# EAGLE design beagleboard (EAGLE 7.7.0)
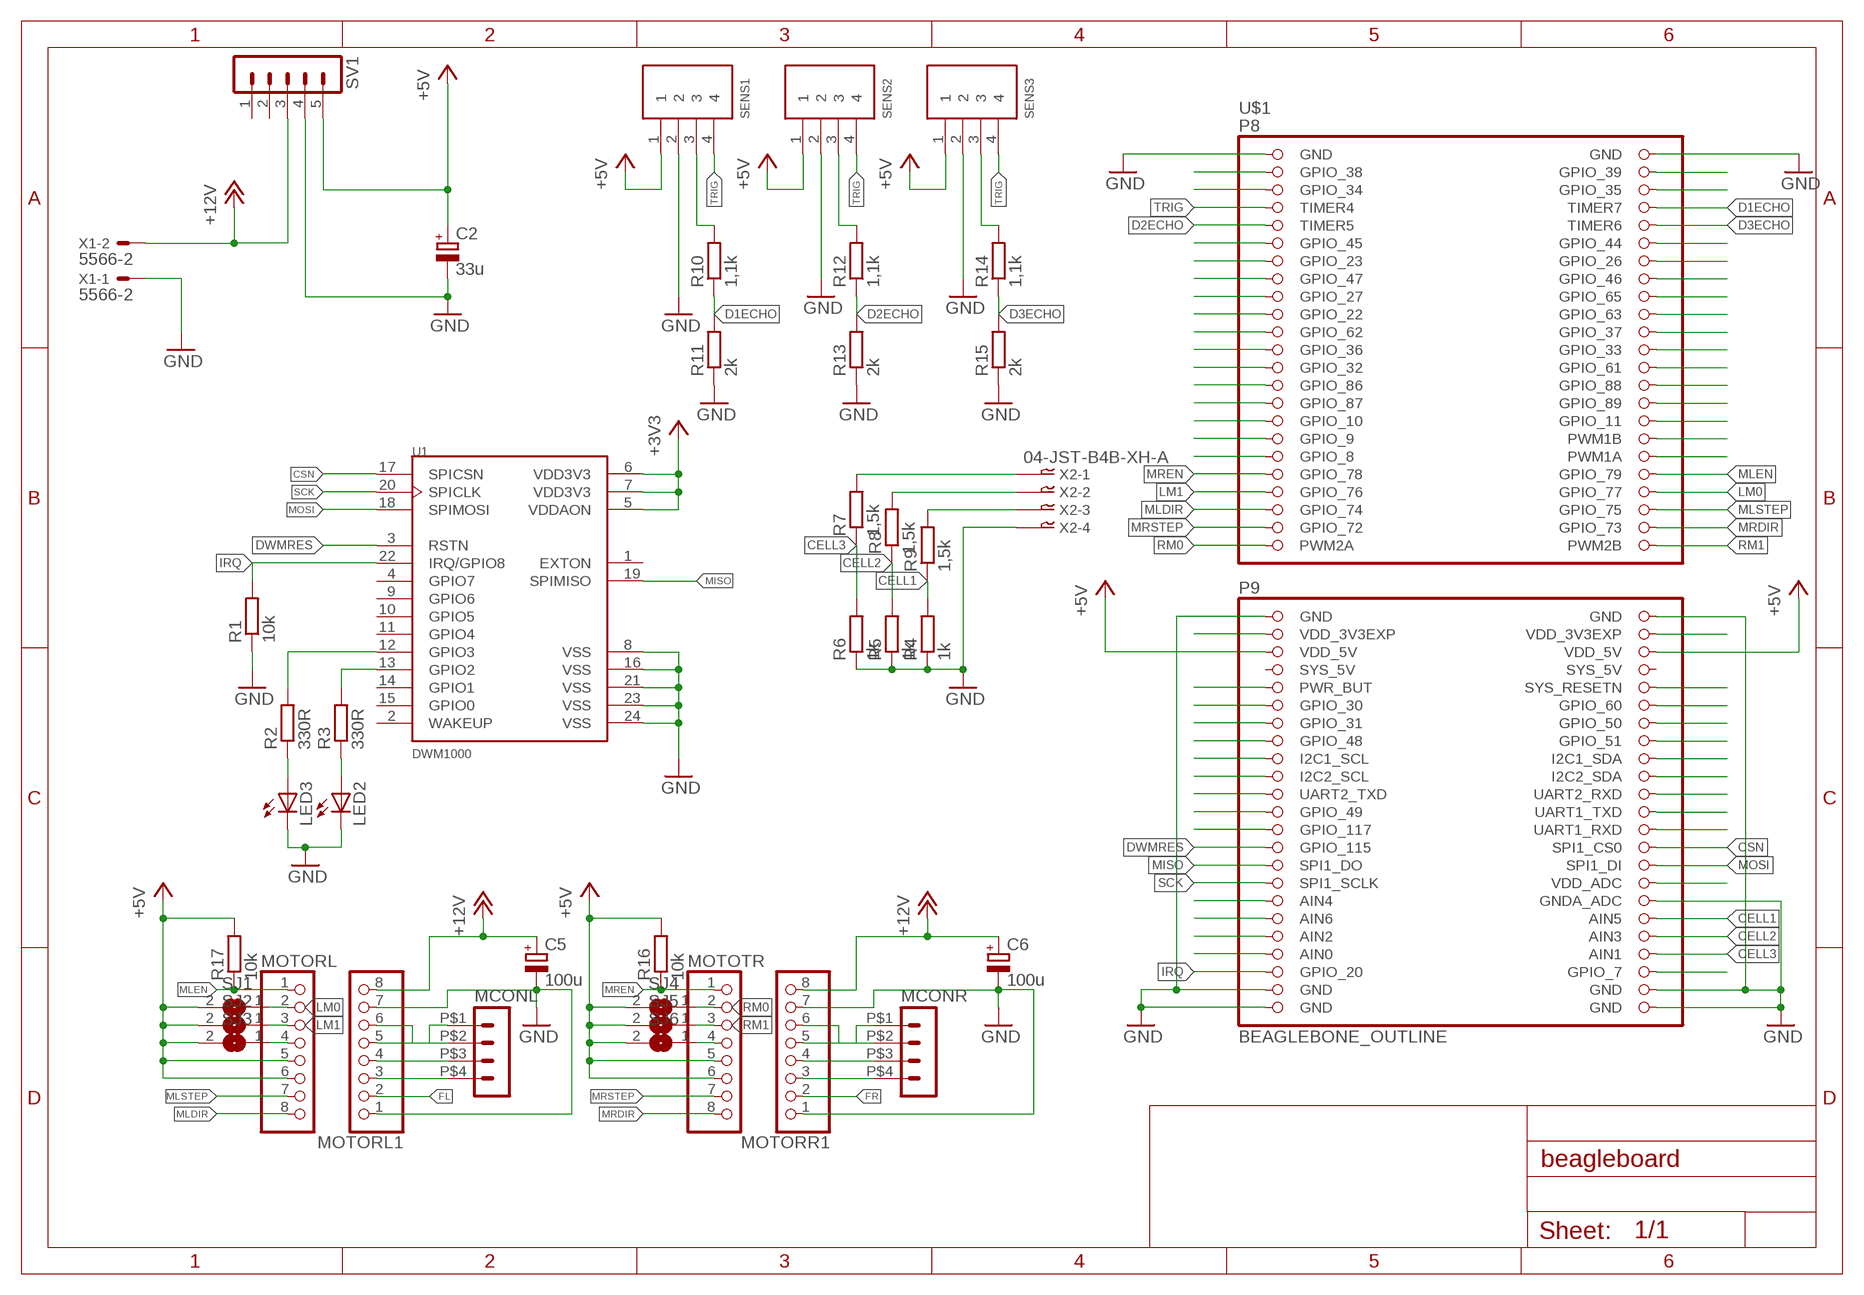
[diagram p0: schematic, sheet 1]

## Parts
C2  33u  CPOL-EU153CLV-0405  [153CLV-0405]
C5  100u  CPOL-EU153CLV-0405  [153CLV-0405]
C6  100u  CPOL-EU153CLV-0405  [153CLV-0405]
LED2  LEDSML0603  [SML0603]
LED3  LEDSML0603  [SML0603]
MCONL  HEADER_POS4_43045-0412  [43045-0412]
MCONR  HEADER_POS4_43045-0412  [43045-0412]
MOTORL  PINHD-1X8  [1X08]
MOTORL1  PINHD-1X8  [1X08]
MOTORR1  PINHD-1X8  [1X08]
MOTOTR  PINHD-1X8  [1X08]
R1  10k  R-EU_R0603  [R0603]
R2  330R  R-EU_R0603  [R0603]
R3  330R  R-EU_R0603  [R0603]
R4  1k  R-EU_R0805  [R0805]
R5  1k  R-EU_R0805  [R0805]
R6  1k  R-EU_R0805  [R0805]
R7  1,5k  R-EU_R0805  [R0805]
R8  1,5k  R-EU_R0805  [R0805]
R9  1,5k  R-EU_R0805  [R0805]
R10  1,1k  R-EU_R0805  [R0805]
R11  2k  R-EU_R0805  [R0805]
R12  1,1k  R-EU_R0805  [R0805]
R13  2k  R-EU_R0805  [R0805]
R14  1,1k  R-EU_R0805  [R0805]
R15  2k  R-EU_R0805  [R0805]
R16  10k  R-EU_R0805  [R0805]
R17  10k  R-EU_R0805  [R0805]
SENS1  4PIN  [B4B-PH-K-S]
SENS2  4PIN  [B4B-PH-K-S]
SENS3  4PIN  [B4B-PH-K-S]
SJ1  SJ  [SJ]
SJ2  SJ  [SJ]
SJ3  SJ  [SJ]
SJ4  SJ  [SJ]
SJ5  SJ  [SJ]
SJ6  SJ  [SJ]
SV1  MA05-1  [MA05-1]
U1  DWM1000  [XCVR_DWM1000]
U$1  BEAGLEBONE_OUTLINE  [BEAGLEBONE_SHIELD]
X1  5566-2  [5566-2]
X2  04-JST-B4B-XH-A  [B4B-XH]

## Nets
+3V3: U1.5(VDDAON) U1.6(VDD3V3) U1.7(VDD3V3)
+5V: C2.+ MOTORL.5 MOTORL.6 MOTOTR.5 MOTOTR.6 R16.2 R17.2 SENS1.1 SENS2.1 SENS3.1 SJ1.2 SJ2.2 SJ3.2 SJ4.2 SJ5.2 SJ6.2 SV1.5 U$1.51(VDD_5V) U$1.52(VDD_5V)
+12V: C5.+ C6.+ MOTORL1.8 MOTORR1.8 SV1.3 X1.2
CELL1: R4.2 R9.1 U$1.82(AIN5)
CELL2: R5.2 R8.1 U$1.84(AIN3)
CELL3: R6.2 R7.1 U$1.86(AIN1)
CSN: U1.17(SPICSN) U$1.74(SPI1_CS0)
D1ECHO: R10.1 R11.2 U$1.8(TIMER7)
D2ECHO: R12.1 R13.2 U$1.9(TIMER5)
D3ECHO: R14.1 R15.2 U$1.10(TIMER6)
D4ECHO: U$1.85(AIN0)
D4TRIG: U$1.83(AIN2)
DWMRES: U1.3(RSTN) U$1.73(GPIO_115)
FL: MOTORL1.2
FR: MOTORR1.2
GND: C2.- C5.- C6.- LED2.C LED3.C MOTORL1.1 MOTORL1.7 MOTORR1.1 MOTORR1.7 R1.1 R4.1 R5.1 R6.1 R11.1 R13.1 R15.1 SENS1.2 SENS2.2 SENS3.2 SV1.4 U1.8(VSS) U1.16(VSS) U1.21(VSS) U1.23(VSS) U1.24(VSS) U$1.1(GND) U$1.2(GND) U$1.47(GND) U$1.80(GNDA_ADC) U$1.89(GND) U$1.90(GND) U$1.91(GND) U$1.92(GND) X1.1 X2.P$4
IRQ: R1.2 U1.22(IRQ/GPIO8) U$1.87(GPIO_20)
LM0: MOTORL.2 SJ1.1 U$1.40(GPIO_77)
LM1: MOTORL.3 SJ2.1 U$1.39(GPIO_76)
MISO: U1.19(SPIMISO) U$1.75(SPI1_DO)
MLDIR: MOTORL.8 U$1.41(GPIO_74)
MLEN: MOTORL.1 R17.1 U$1.38(GPIO_79)
MLSTEP: MOTORL.7 U$1.42(GPIO_75)
MOSI: U1.18(SPIMOSI) U$1.76(SPI1_DI)
MRDIR: MOTOTR.8 U$1.44(GPIO_73)
MREN: MOTOTR.1 R16.1 U$1.37(GPIO_78)
MRSTEP: MOTOTR.7 U$1.43(GPIO_72)
N$1: MCONL.P$3 MOTORL1.4
N$2: R3.2 U1.13(GPIO2)
N$3: R2.2 U1.12(GPIO3)
N$4: R7.2 X2.P$1
N$5: LED2.A R3.1
N$6: LED3.A R2.1
N$7: R8.2 X2.P$2
N$8: R9.2 X2.P$3
N$9: MCONL.P$2 MOTORL1.6
N$10: MCONL.P$1 MOTORL1.5
N$11: MCONL.P$4 MOTORL1.3
N$12: MCONR.P$2 MOTORR1.6
N$13: MCONR.P$3 MOTORR1.4
N$14: MCONR.P$4 MOTORR1.3
N$15: MCONR.P$1 MOTORR1.5
N$16: U$1.48(GND)
N$17: U$1.3(GPIO_38)
N$18: U$1.4(GPIO_39)
N$19: U$1.5(GPIO_34)
N$20: U$1.12(GPIO_44)
N$21: U$1.6(GPIO_35)
N$22: U$1.16(GPIO_46)
N$23: U$1.11(GPIO_45)
N$25: U$1.14(GPIO_26)
N$26: U$1.15(GPIO_47)
N$27: U$1.18(GPIO_65)
N$28: U$1.20(GPIO_63)
N$29: U$1.22(GPIO_37)
N$30: U$1.24(GPIO_33)
N$31: U$1.26(GPIO_61)
N$32: U$1.28(GPIO_88)
N$33: U$1.30(GPIO_89)
N$34: U$1.32(GPIO_11)
N$35: U$1.34(PWM1B)
N$36: U$1.36(PWM1A)
N$39: U$1.55(PWR_BUT)
N$40: U$1.49(VDD_3V3EXP)
N$41: U$1.57(GPIO_30)
N$44: U$1.13(GPIO_23)
N$46: U$1.17(GPIO_27)
N$47: U$1.19(GPIO_22)
N$48: U$1.21(GPIO_62)
N$49: U$1.23(GPIO_36)
N$50: U$1.25(GPIO_32)
N$51: U$1.27(GPIO_86)
N$52: MOTORL.4 SJ3.1
N$53: U$1.59(GPIO_31)
N$54: U$1.61(GPIO_48)
N$55: U$1.71(GPIO_117)
N$56: U$1.29(GPIO_87)
N$57: U$1.31(GPIO_10)
N$58: U$1.33(GPIO_9)
N$59: U$1.35(GPIO_8)
N$60: U$1.65(I2C2_SCL)
N$61: U$1.50(VDD_3V3EXP)
N$62: U$1.56(SYS_RESETN)
N$63: U$1.58(GPIO_60)
N$64: U$1.60(GPIO_50)
N$65: U$1.62(GPIO_51)
N$66: MOTOTR.4 SJ6.1
N$67: U$1.81(AIN6)
N$68: U$1.64(I2C1_SDA)
N$69: U$1.66(I2C2_SDA)
N$70: U$1.78(VDD_ADC)
N$71: U$1.68(UART2_RXD)
N$72: U$1.70(UART1_TXD)
N$73: U$1.72(UART1_RXD)
N$74: U$1.67(UART2_TXD)
N$75: U$1.69(GPIO_49)
N$76: R10.2 SENS1.3
N$77: U$1.88(GPIO_7)
N$78: R12.2 SENS2.3
N$79: U$1.63(I2C1_SCL)
N$80: R14.2 SENS3.3
N$104: U$1.79(AIN4)
RM0: MOTOTR.2 SJ4.1 U$1.45(PWM2A)
RM1: MOTOTR.3 SJ5.1 U$1.46(PWM2B)
SCK: U1.20(SPICLK) U$1.77(SPI1_SCLK)
TRIG: SENS1.4 SENS2.4 SENS3.4 U$1.7(TIMER4)
Unconnected: SV1.1 SV1.2 U1.1(EXTON) U1.2(WAKEUP) U1.4(GPIO7) U1.9(GPIO6) U1.10(GPIO5) U1.11(GPIO4) U1.14(GPIO1) U1.15(GPIO0) U$1.54(SYS_5V)

## Power pins joined to a net without a drawn wire
SYS_5V: U$1.53(SYS_5V)

## Library data of the parts
C2 C5 C6 = rcl:CPOL-EU: POLARIZED CAPACITOR, European symbol
LED2 LED3 = led:LED: LED OSRAM: - CHIPLED LG R971, LG N971, LY N971, LG Q971, LY Q971, LO R971, LY R971 LH N974, LH R974 LS Q976, LO Q976, LY Q976 LO Q996 - Hyper CHIPLED LW Q18S LB Q993, LB Q99A, LB R99A - SideLED LS A670, LO A670, LY A670, LG A670, LP A670 LB A673, LV A673, LT A673, LW A673 LH A674 LY A675 LS A676, LA A676, LO A676, LY A676, LW A676 LS A679, LY A679, LG A679 - Hyper Micro SIDELED® LS Y876, LA Y876, LO Y876, LY Y876 LT Y87S - SmartLED LW L88C, LW L88S LB L89C, LB L89S, LG L890 LS L89K, LO L89K, LY L89K LS L896, LA L896, LO L896, LY L896 - TOPLED LS T670, LO T670, LY T670, LG T670, LP T670 LSG T670, LSP T670, LSY T670, LOP T670, LYG T670 LG T671, LOG T671, LSG T671 LB T673, LV T673, LT T673, LW T673 LH T674 LS T676, LA T676, LO T676, LY T676, LB T676, LH T676, LSB T676, LW T676 LB T67C, LV T67C, LT T67C, LS T67K, LO T67K, LY T67K, LW E67C LS E67B, LA E67B, LO E67B, LY E67B, LB E67C, LV E67C, LT E67C LW T67C LS T679, LY T679, LG T679 LS T770, LO T770, LY T770, LG T770, LP T770 LB T773, LV T773, LT T773, LW T773 LH T774 LS E675, LA E675, LY E675, LS T675 LS T776, LA T776, LO T776, LY T776, LB T776 LHGB T686 LT T68C, LB T68C - Hyper Mini TOPLED® LB M676 - Mini TOPLED Santana® LG M470 LS M47K, LO M47K, LY M47K Source: http://www.osram.convergy.de LUXEON: - LUMILED® LXK2-PW12-R00, LXK2-PW12-S00, LXK2-PW14-U00, LXK2-PW14-V00 LXK2-PM12-R00, LXK2-PM12-S00, LXK2-PM14-U00 LXK2-PE12-Q00, LXK2-PE12-R00, LXK2-PE12-S00, LXK2-PE14-T00, LXK2-PE14-U00 LXK2-PB12-K00, LXK2-PB12-L00, LXK2-PB12-M00, LXK2-PB14-N00, LXK2-PB14-P00, LXK2-PB14-Q00 LXK2-PR12-L00, LXK2-PR12-M00, LXK2-PR14-Q00, LXK2-PR14-R00 LXK2-PD12-Q00, LXK2-PD12-R00, LXK2-PD12-S00 LXK2-PH12-R00, LXK2-PH12-S00 LXK2-PL12-P00, LXK2-PL12-Q00, LXK2-PL12-R00 Source: www.luxeon.com KINGBRIGHT: KA-3528ASYC Source: www.kingbright.com
MCONL MCONR = con-molex-micro-fit-3_0:HEADER_POS4_?: Molex - Micro-Fit 3.0 Series connector, 3.00mm (0.118") pitch header, 4 positions.
MOTORL MOTORL1 MOTORR1 MOTOTR = pinhead:PINHD-1X8: PIN HEADER
R1-R17 = rcl:R-EU_: RESISTOR, European symbol
SENS1-SENS3 = libsjst_eph:4PIN
SJ1-SJ6 = jumper:SJ: SMD solder JUMPER
SV1 = con-lstb:MA05-1: PIN HEADER; OC_FARNELL: unknown; OC_NEWARK: unknown
U1 = DWM1000:DWM1000: Mod Ieee802.15.4-2011 Uwb Txrx
U$1 = adafruit:BEAGLEBONE_OUTLINE: Should match A3 pinout - but not completely tested
X1 = con-molex:5566-2: Mini FIT connector 2 pol Source: http://www.molex.com; OC_FARNELL: 1822072; OC_NEWARK: unknown
X2 = bt_con-jst-xh:04-JST: JST CONNECTOR

## Net classes
0 default: clearance 0.205 mm

## Board
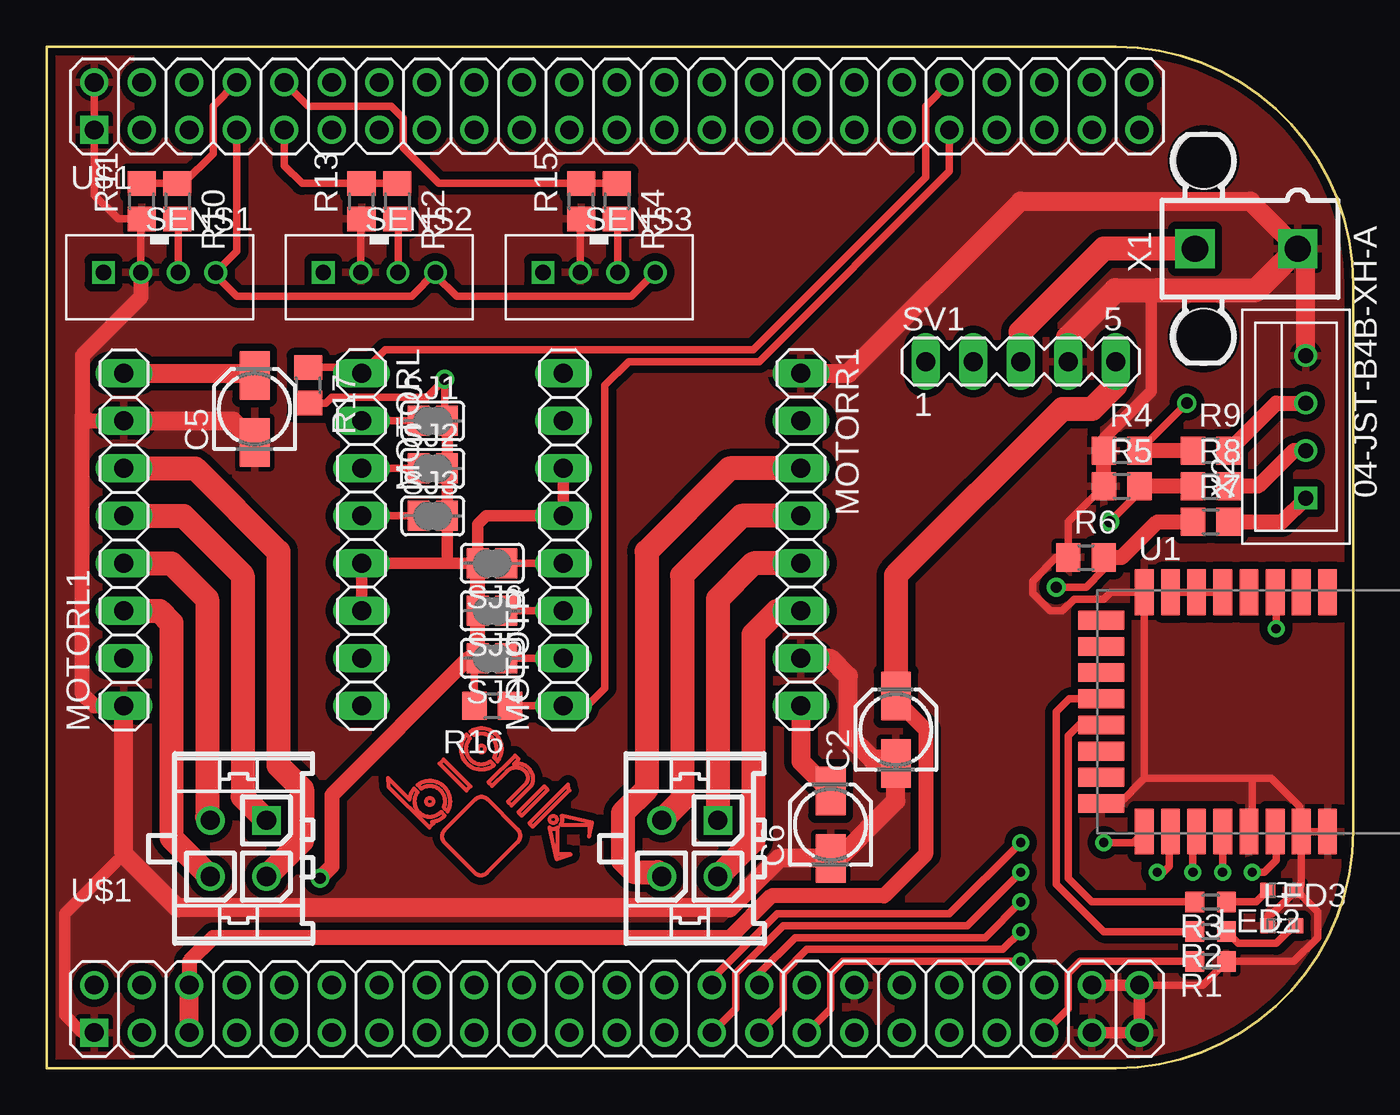
[diagram p1: board, top side]
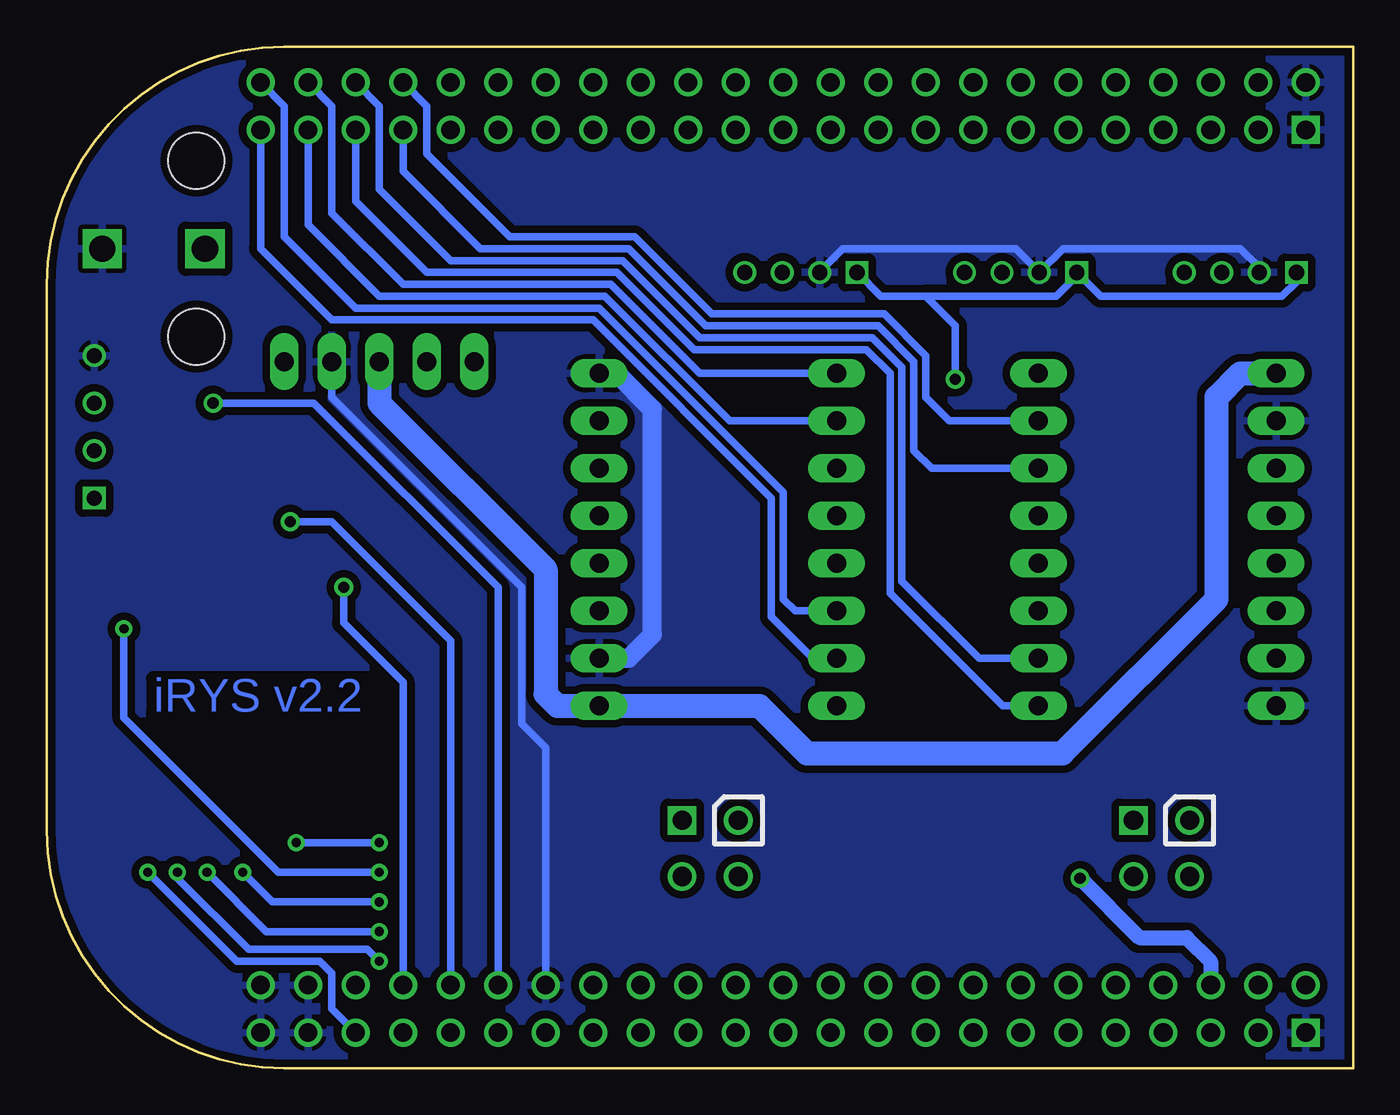
[diagram p2: board, bottom side, seen from below]

Size 69.85 x 54.61 mm. Coordinates in mm from the lower left corner, seen from the top.
Copper layers (1*16): Top 0.035mm / dielectric 1.5mm / Bottom 0.035mm
Design rules "default *": minimum track width 10mil, minimum drill 24mil, track to track 8mil, track to pad 8mil, pad to pad 8mil, via to via 8mil, smd to smd 8mil, copper to edge 8mil, drill to drill 8mil, minimum pad ring 8mil, minimum via ring 8mil, stop-mask expansion 4mil, vias tented up to drill 0mil, thermal gap 10mil

### Footprints (pad centres in the part's own frame; a part is rotated, then mirrored left to right if it is on the bottom)
153CLV-0405 = smd 2.6 x 1.6: + 1.8,0; - -1.8,0
SML0603 = smd 0.8 x 0.8: A 0.75,0; C -0.75,0
43045-0412 = drill 1.02 square: P$1 1.5,0 | drill 1.02: P$2 -1.5,0; P$3 1.5,3; P$4 -1.5,3
1X08 = drill 1.016 long: 1 -8.89,0; 2 -6.35,0; 3 -3.81,0; 4 -1.27,0; 5 1.27,0; 6 3.81,0; 7 6.35,0; 8 8.89,0
R0603 = smd 1 x 1.1: 1 -0.85,0; 2 0.85,0
R0805 = smd 1.3 x 1.5: 1 -0.95,0; 2 0.95,0
B4B-PH-K-S = drill 0.813 square: 1 3,0 | drill 0.813: 2 1,0; 3 -1,0; 4 -3,0
SJ = smd 1.168 x 1.6: 1 -0.762,0; 2 0.762,0
MA05-1 = drill 1.016 long: 1 -5.08,0; 2 -2.54,0; 3 0,0; 4 2.54,0; 5 5.08,0
XCVR_DWM1000 = smd 2.45 x 1: 1 -6.4,1.8; 2 -6.4,0.4; 3 -6.4,-1; 4 -6.4,-2.4; 5 -6.4,-3.8; 6 -6.4,-5.2; 7 -6.4,-6.6; 8 -6.4,-8; 17 6.4,-8; 18 6.4,-6.6; 19 6.4,-5.2; 20 6.4,-3.8; 21 6.4,-2.4; 22 6.4,-1; 23 6.4,0.4; 24 6.4,1.8 | smd 1 x 2.45: 9 -4.9,-10.295; 10 -3.5,-10.295; 11 -2.1,-10.295; 12 -0.7,-10.295; 13 0.7,-10.295; 14 2.1,-10.295; 15 3.5,-10.295; 16 4.9,-10.295
BEAGLEBONE_SHIELD = drill 1 square: 1 4.445,2.54; 47 52.705,2.54 | drill 1: 2 1.905,2.54; 3 4.445,5.08; 4 1.905,5.08; 5 4.445,7.62; 6 1.905,7.62; 7 4.445,10.16; 8 1.905,10.16; 9 4.445,12.7; 10 1.905,12.7; 11 4.445,15.24; 12 1.905,15.24; 13 4.445,17.78; 14 1.905,17.78; 15 4.445,20.32; 16 1.905,20.32; 17 4.445,22.86; 18 1.905,22.86; 19 4.445,25.4; 20 1.905,25.4; 21 4.445,27.94; 22 1.905,27.94; 23 4.445,30.48; 24 1.905,30.48; 25 4.445,33.02; 26 1.905,33.02; 27 4.445,35.56; 28 1.905,35.56; 29 4.445,38.1; 30 1.905,38.1; 31 4.445,40.64; 32 1.905,40.64; 33 4.445,43.18; 34 1.905,43.18; 35 4.445,45.72; 36 1.905,45.72; 37 4.445,48.26; 38 1.905,48.26; 39 4.445,50.8; 40 1.905,50.8; 41 4.445,53.34; 42 1.905,53.34; 43 4.445,55.88; 44 1.905,55.88; 45 4.445,58.42; 46 1.905,58.42; 48 50.165,2.54; 49 52.705,5.08; 50 50.165,5.08; 51 52.705,7.62; 52 50.165,7.62; 53 52.705,10.16; 54 50.165,10.16; 55 52.705,12.7; 56 50.165,12.7; 57 52.705,15.24; 58 50.165,15.24; 59 52.705,17.78; 60 50.165,17.78; 61 52.705,20.32; 62 50.165,20.32; 63 52.705,22.86; 64 50.165,22.86; 65 52.705,25.4; 66 50.165,25.4; 67 52.705,27.94; 68 50.165,27.94; 69 52.705,30.48; 70 50.165,30.48; 71 52.705,33.02; 72 50.165,33.02; 73 52.705,35.56; 74 50.165,35.56; 75 52.705,38.1; 76 50.165,38.1; 77 52.705,40.64; 78 50.165,40.64; 79 52.705,43.18; 80 50.165,43.18; 81 52.705,45.72; 82 50.165,45.72; 83 52.705,48.26; 84 50.165,48.26; 85 52.705,50.8; 86 50.165,50.8; 87 52.705,53.34; 88 50.165,53.34; 89 52.705,55.88; 90 50.165,55.88; 91 52.705,58.42; 92 50.165,58.42
5566-2 = drill 1.4 square: 1 0,-2.75; 2 0,2.75 | hole 3: 4.7,2.29; -4.7,2.29
B4B-XH = drill 0.8 square: P$1 -3.81,0 | drill 0.8: P$2 -1.27,0; P$3 1.27,0; P$4 3.81,0

### Placement (x,y rotation side)
C2  45.4,18.1 90 top
C5  11.11,35.24 90 top
C6  41.91,13.02 90 top
LED2  66.04,9.53 180 top
LED3  66.04,7.62 0 top
MCONL  11.75,11.75 90 top
MCONR  35.88,11.75 90 top
MOTORL  16.83,28.26 270 top
MOTORL1  4.13,28.26 90 top
MOTORR1  40.32,28.26 270 top
MOTOTR  27.62,28.26 90 top
R1  62.23,5.72 180 top
R2  62.23,7.3 180 top
R3  62.23,8.89 180 top
R4  57.47,33.02 0 top
R5  57.47,31.12 0 top
R6  55.56,27.31 0 top
R7  62.23,29.21 0 top
R8  62.23,31.12 0 top
R9  62.23,33.02 0 top
R10  6.99,46.36 270 top
R11  5.08,46.36 90 top
R12  18.73,46.36 270 top
R13  16.83,46.36 90 top
R14  30.48,46.36 270 top
R15  28.57,46.36 90 top
R16  23.81,19.37 180 top
R17  13.97,36.51 270 top
SENS1  6.03,42.55 180 top
SENS2  17.78,42.55 180 top
SENS3  29.53,42.55 180 top
SJ1  20.64,34.61 0 top
SJ2  20.64,32.07 0 top
SJ3  20.64,29.53 0 top
SJ4  23.81,21.91 180 top
SJ5  23.81,24.45 180 top
SJ6  23.81,26.99 180 top
SV1  52.07,37.78 0 top
U1  66.67,19.05 270 top
U$1  0,54.61 270 top
X1  64.13,43.82 90 top
X2  67.31,34.29 90 top

### Tracks (layer width: path | path; a pad name or v marks a point on that pad's centre or on a via)
+3V3
  Top 0.406: U1.5 U1.6 U1.7
+5V  (via drill 0.6, 0.6 pad 1.02)
  Top 0.406: SJ1.2 21.27,34.73 v21.27,36.83 20.32,35.88 15.24,35.88 14.93,35.56 R17.2 | R16.2 22.86,21.72 SJ4.2
  Top 0.61: MOTOTR.6 MOTOTR.5 23.5,29.53 23.05,29.08 SJ6.2 21.27,26.99 | MOTORL.6 MOTORL.5 21.27,26.99 | 21.27,26.99 21.4,27.12 SJ3.2 SJ2.2 SJ1.2
  Top 0.813: SJ6.2 SJ5.2 SJ4.2 22.54,21.91 15.24,14.61 15.24,10.8 v14.61,10.16 | 45.4,26.35 45.4,19.69 46.99,18.1 46.99,11.43 44.77,9.21 38.73,9.21 36.51,6.99 8.89,6.99 7.62,5.72 U$1.52
  Top 1.016: U$1.51 U$1.52
  Top 1.27: SV1.5 57.15,36.51 55.88,35.24 54.29,35.24 45.4,26.35 C2.+
  Bottom 0.406: SENS1.1 3.03,42.05 3.81,41.27 13.51,41.27 SENS2.1 14.78,42.37 15.88,41.27 22.86,41.27 | SENS3.1 25.26,41.27 22.86,41.27 | 22.86,41.27 21.27,39.69 v21.27,36.83
  Bottom 0.813: v14.61,10.16 11.43,6.99 8.89,6.99 7.62,5.72 U$1.52
+12V
  Top 1.016: MOTORL1.8 11.01,37.15 C5.+ | MOTORR1.8 40.32,16.41 C6.+
  Top 1.27: X1.2 56.52,43.82 52.07,39.37 SV1.3
  Bottom 1.27: SV1.3 52.07,35.56 43.18,26.67 43.18,20 42.55,19.37 MOTORR1.8 31.75,19.37 29.21,16.83 15.56,16.83 7.3,25.08 7.3,35.88 6.03,37.15 MOTORL1.8
CELL1  (via drill 0.6 pad 1.02)
  Top 0.406: R4.2 v60.96,35.56
  Top 0.813: R9.1 R4.2
  Bottom 0.406: v60.96,35.56 55.56,35.56 45.72,25.72 U$1.82
CELL2  (via drill 0.6 pad 1.02)
  Top 0.406: R5.2 58.42,30.8 v56.83,29.21
  Top 0.813: R8.1 R5.2
  Bottom 0.406: v56.83,29.21 54.61,29.21 48.26,22.86 U$1.84
CELL3  (via drill 0.6 pad 1.02)
  Top 0.406: R6.2 56.51,26.67 55.56,25.72 v53.98,25.72
  Top 0.813: R6.2 57.47,27.31 59.37,29.21 R7.1
  Bottom 0.406: v53.98,25.72 53.98,23.81 50.8,20.64 U$1.86
CSN  (via drill 0.5)
  Top 0.406: U$1.74 35.56,4.76 39.05,8.26 48.26,8.26 v52.07,12.07 | v56.52,12.07 58.09,12.07 U1.17
  Bottom 0.406: v52.07,12.07 v56.52,12.07
D1ECHO
  Top 0.406: R11.2 R10.1 7.3,47.3 8.89,48.9 8.89,51.44 U$1.8
D2ECHO
  Top 0.406: R12.1 R13.2 13.66,47.3 12.7,48.26 U$1.9
D3ECHO
  Top 0.406: R14.1 R15.2 20.96,47.3 19.05,49.21 19.05,50.8 18.41,51.44 13.97,51.44 U$1.10
DWMRES  (via drill 0.5)
  Top 0.406: U$1.73 36.83,3.18 36.83,5.08 39.37,7.62 49.21,7.62 v52.07,10.48 | v65.72,23.5 65.72,25.4 U1.3
  Bottom 0.406: v52.07,10.48 57.47,10.48 65.72,18.73 v65.72,23.5
GND
  Top 0.406: U1.24 U1.23 | U1.23 67.07,9.81 LED2.C | LED3.C 65.29,8.14 65.4,8.26 65.52,8.26 LED2.C | R1.1 66.67,5.72 67.94,6.99 67.94,8.37 LED2.C | U1.16 57.33,14.15 58.68,15.5 | SENS2.2 16.78,45.36 R13.1 | SENS3.2 28.53,45.36 R15.1 | SENS1.2 5.03,45.36 R11.1 3.81,45.4 2.54,46.67 U$1.1 U$1.2 | R5.1 54.61,29.21 R6.1 53.98,27.31 52.7,26.04 52.7,25.4 53.66,24.45 54.29,24.45 54.93,25.08 56.52,25.08 56.88,25.45 U1.8 58.68,15.5 | U$1.92 61.81,4.45 R1.1 | U1.21 64.45,12.83 64.45,15.5 | R1.1 62.87,5.72 | 58.68,15.5 64.45,15.5 | 64.45,15.5 65.47,15.5 66.99,13.97 66.99,12.73 U1.23
  Top 0.61: U$1.89 U$1.91 U$1.92 U$1.90 | U$1.47 1.91,1.91 0.95,2.86 0.95,8.26 4.13,11.43 | R4.1 56.52,33.66 59.05,36.2 59.05,41.27 59.37,41.59
  Top 0.813: 45.19,16.51 C2.- | R5.1 R4.1 | SENS1.2 5.03,41.23 1.91,38.1 1.91,34.93 | 1.91,34.93 2.22,34.61 MOTORL1.7 | MOTORL1.1 2.54,19.37 1.91,20 1.91,34.93
  Top 1.016: MOTORL1.7 9.95,34.61 C5.- | X2.P$4 67.31,43.39 X1.1 64.34,46.36 52.07,46.36 42.86,37.15 MOTORR1.1 | MOTORL1.1 4.13,11.43 6.99,8.57 36.51,8.57 39.16,11.22 C6.- 42.33,11.22 45.4,14.29 C2.- | 45.19,16.51 44.13,16.51 42.86,17.78 42.86,20.96 41.91,21.91 MOTORR1.7
  Top 1.27: SV1.4 54.61,39.05 57.15,41.59 59.37,41.59 64.66,41.59 X1.1
  Bottom 0.406: SENS1.2 5.03,42.82 6.03,43.82 15.51,43.82 SENS2.2 18.05,43.82 27.3,43.82 28.53,42.59 SENS3.2 | U$1.80 43.18,17.15 44.45,18.42 44.45,25.72 54.61,35.88 SV1.4
  Bottom 1.016: MOTORR1.7 38.73,21.91 37.47,23.18 37.47,35.24 39.37,37.15 MOTORR1.1
  pour Top (isolate 0.406): 0,54.61 0,0 57.79,0 arc90 69.85,12.07 69.85,42.55 arc90 57.79,54.61 57.15,54.61
  pour Bottom (isolate 0.406): 0,0 57.79,0 arc90 69.85,12.07 69.85,41.91 69.85,42.55 arc90 57.79,54.61 0,54.61
IRQ  (via drill 0.5)
  Top 0.406: v64.45,10.48 65.09,10.48 65.72,11.11 65.72,12.6 U1.22 | U$1.87 54.61,3.18 54.61,5.08 55.24,5.72 R1.2
  Bottom 0.406: v64.45,10.48 59.69,5.72 55.24,5.72 54.61,5.08 54.61,3.18 U$1.87
LM0
  Top 0.406: MOTORL.2 SJ1.1
  Bottom 0.406: U$1.40 49.53,51.44 49.53,48.9 45.09,44.45 38.42,44.45 34.29,40.32 25.08,40.32 22.86,38.1 22.86,35.88 21.59,34.61 MOTORL.2
LM1
  Top 0.406: MOTORL.3 SJ2.1
  Bottom 0.406: U$1.39 50.8,47.94 46.67,43.82 38.73,43.82 34.61,39.69 25.4,39.69 23.5,37.78 23.5,33.02 22.54,32.07 MOTORL.3
MISO  (via drill 0.5)
  Top 0.406: U$1.75 39.37,3.18 39.37,5.08 40.64,6.35 51.12,6.35 v52.07,7.3 | v61.28,10.48 61.28,12.45 U1.19
  Bottom 0.406: v52.07,7.3 58.1,7.3 v61.28,10.48
MLDIR
  Bottom 0.406: U$1.41 53.34,46.36 49.53,42.55 39.37,42.55 35.24,38.42 26.04,38.42 24.77,37.15 24.77,25.4 18.73,19.37 MOTORL.8
MLEN
  Top 0.406: U$1.38 46.99,51.44 46.99,47.62 37.78,38.42 18.1,38.42 MOTORL.1 16.51,37.46 R17.1
MLSTEP
  Bottom 0.406: U$1.42 52.07,51.44 52.07,46.99 48.26,43.18 39.05,43.18 34.93,39.05 25.72,39.05 24.13,37.47 24.13,26.04 20,21.91 MOTORL.7
MOSI  (via drill 0.5)
  Top 0.406: v52.07,8.89 50.16,6.99 40.01,6.99 38.1,5.08 U$1.76 | v59.37,10.48 59.69,10.48 60.01,10.8 60.01,12.58 U1.18
  Bottom 0.406: v52.07,8.89 57.79,8.89 v59.37,10.48
MRDIR
  Bottom 0.406: U$1.44 54.61,51.44 54.61,45.72 50.8,41.91 39.69,41.91 34.93,37.15 MOTOTR.8
MREN
  Top 0.406: U$1.37 48.26,47.94 38.1,37.78 31.12,37.78 29.84,36.51 29.84,20.32 28.89,19.37 MOTOTR.1 R16.1
MRSTEP
  Bottom 0.406: U$1.43 55.88,45.09 52.07,41.27 40.01,41.27 33.34,34.61 MOTOTR.7
N$1
  Top 1.27: MOTORL1.4 6.67,26.99 8.57,25.08 8.57,13.42 MCONL.P$3
N$2
  Top 0.406: R3.2 55.88,8.89 54.61,10.16 54.61,17.78 55.24,18.42 56.31,18.42 U1.13
N$3
  Top 0.406: U1.12 54.68,19.75 53.98,19.05 53.98,9.84 56.52,7.3 R2.2
N$4
  Top 0.813: R7.2 66.04,29.21 X2.P$1
N$5
  Top 0.406: R3.1 64.65,8.89 LED2.A
N$6
  Top 0.406: LED3.A 66.15,7.1 65.72,6.67 63.71,6.67 R2.1
N$7
  Top 0.813: X2.P$2 66.67,33.02 64.77,31.12 R8.2
N$8
  Top 0.813: R9.2 65.72,35.56 X2.P$3
N$9
  Top 1.27: MOTORL1.6 7.94,32.07 12.38,27.62 12.38,16.19 13.65,14.92 13.65,12.15 MCONL.P$2
N$10
  Top 1.27: MOTORL1.5 7.3,29.53 10.48,26.35 10.48,14.52 MCONL.P$1
N$11
  Top 1.27: MOTORL1.3 6.03,24.45 6.67,23.81 6.67,12.33 MCONL.P$4
N$12
  Top 1.27: MOTORR1.6 39.05,24.45 37.78,23.18 37.78,12.15 MCONR.P$2
N$13
  Top 1.27: MOTORR1.4 37.15,29.53 33.97,26.35 33.97,14.34 MCONR.P$3
N$14
  Top 1.27: MOTORR1.3 36.51,32.07 32.07,27.62 32.07,14.92 30.8,13.65 30.8,11.11 31.43,10.48 32.65,10.48 MCONR.P$4
N$15
  Top 1.27: MOTORR1.5 37.78,26.99 35.88,25.08 MCONR.P$1
N$24
  Top 0.203: 23.53,10.45 25.19,12.1 arc90 25.19,12.75 23.56,14.37 arc90 22.92,14.37 21.26,12.71 arc90 21.26,12.07 22.88,10.45 arc90 23.53,10.45
N$52
  Top 0.406: MOTORL.4 SJ3.1
N$66
  Top 0.406: MOTOTR.4 SJ6.1
N$76
  Top 0.406: SENS1.3 7.03,45.36 R10.2
N$78
  Top 0.406: SENS2.3 18.78,45.36 R12.2
N$80
  Top 0.406: SENS3.3 30.53,45.36 R14.2
N$82
  Top 0.203: 19.83,15.15 | 19.83,15.15 20.02,14.95 arc-147 21.23,13.94 21.44,13.73 arc155 19.83,15.15
N$84
  Top 0.203: 26.87,12.86 27.24,11.18 28.01,11.43 27.33,11.43 27.33,12.88 arc-74 26.87,12.86
N$86
  Top 0.203: 27.48,13.02 29,13.02 29,12.39 29.16,13.12 27.52,13.49 arc-61 27.48,13.02
N$87
  Top 0.203: 25.99,12.91 27.94,14.86 27.86,15.16 25.8,13.11 25.99,12.91
N$88
  Top 0.203: 25.4,13.5 26.78,14.88 26.59,15.07 25.21,13.69 25.4,13.5
N$89
  Top 0.203: 25.6,15.86 arc90 24.59,15.86
N$90
  Top 0.203: 24.59,15.86 23.81,15.1 23.61,15.29 25.04,16.71 25.23,16.52 24.99,16.27
N$91
  Top 0.203: 25.99,15.61 arc90 24.99,16.27
N$92
  Top 0.203: 25.99,15.61 arc-56 25.83,15.03 24.86,14.05 24.65,14.25 25.6,15.19 arc90 25.6,15.86
N$93
  Top 0.203: 22.65,15.07 21.23,16.49 21.01,16.28 22.43,14.85 22.65,15.07
N$94
  Top 0.203: 19.39,14.37 18.23,15.52 18.27,15.06 20.45,12.88 20.67,13.09 20.59,13.17 arc41 21.27,13.51
N$95
  Top 0.203: 19.39,14.37 arc-34 19.63,14.96 19.82,14.76 arc174 21.08,13.7 21.27,13.51
N$97
  Top 0.203: 22.66,18.01 arc-159 24.1,16.4 23.91,16.6 arc151 22.86,17.8
N$98
  Top 0.203: 22.66,18.01 22.86,17.8
N$99
  Top 0.203: 23.91,16.21 arc-172 22.45,17.84 22.64,17.64 arc170 23.72,16.41
N$100
  Top 0.203: 23.91,16.21 23.72,16.41
RM0
  Top 0.406: MOTOTR.2 SJ4.1
  Bottom 0.406: U$1.45 58.42,43.82 54.61,40.01 40.64,40.01 31.12,30.48 31.12,24.13 28.89,21.91 MOTOTR.2
RM1
  Top 0.406: MOTOTR.3 SJ5.1
  Bottom 0.406: U$1.46 57.15,51.44 57.15,44.45 53.34,40.64 40.32,40.64 30.48,30.8 30.48,25.08 29.84,24.45 MOTOTR.3
SCK  (via drill 0.5)
  Top 0.406: U$1.77 41.91,3.18 41.91,5.08 42.55,5.72 v52.07,5.72 | v62.87,10.48 62.87,12.64 U1.20
  Bottom 0.406: v62.87,10.48 62.87,10.16 59.05,6.35 52.7,6.35 v52.07,5.72
TRIG
  Top 0.406: SENS3.4 31.26,41.27 21.91,41.27 20.78,42.4 SENS2.4 19.51,41.27 10.16,41.27 9.03,42.4 SENS1.4 10.16,43.67 U$1.7
(copper drawn outside any net)
  shapes: Top circle x3

### Text on the board
Bottom: iRYS v2.2